# EAGLE schematic EXTRUSOR_1 (EAGLE 7.2.0)
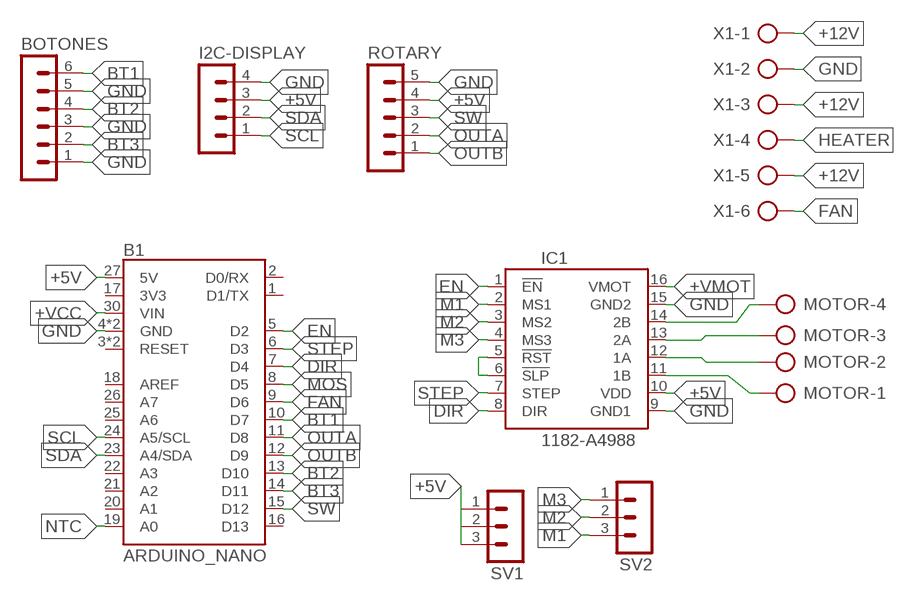
[diagram p0: schematic, sheet 1]

## Parts
B1  ARDUINO_NANO  [NANO]
BOTONES  MA06-1  [MA06-1]
I2C-DISPLAY  MA04-1  [MA04-1]
IC1  1182-A4988  [A4988]
MOTOR  AK500/4  [AK500/4]
ROTARY  MA05-1  [MA05-1]
SV1  MA03-1  [MA03-1]
SV2  MA03-1  [MA03-1]
X1  AK500/6  [AK500/6]

## Nets
+5V: B1.27(5V) I2C-DISPLAY.3 IC1.10(VDD) IC1.11(1B) MOTOR.1 ROTARY.4 SV1.1 SV1.2 SV1.3
+12V: X1.1 X1.3 X1.5
+VCC: B1.30(VIN)
+VMOT: IC1.16(VMOT)
BT1: BOTONES.6
BT2: BOTONES.4
BT3: BOTONES.2
DIR: IC1.8(DIR)
EN: B1.5(D2) IC1.1(!EN)
FAN: X1.6
GND: B1.4(GND) B1.29(GND) BOTONES.1 BOTONES.3 BOTONES.5 I2C-DISPLAY.4 IC1.9(GND1) IC1.15(GND2) ROTARY.5 X1.2
HEATER: X1.4
M1: IC1.2(MS1) SV2.3
M2: IC1.3(MS2) SV2.2
M3: IC1.4(MS3) SV2.1
N$2: IC1.12(1A) MOTOR.2
N$3: IC1.13(2A) MOTOR.3
N$4: IC1.14(2B) MOTOR.4
N$10: IC1.5(!RST) IC1.6(!SLP)
NTC: B1.19(A0)
OUTA: ROTARY.2
OUTB: ROTARY.1
SCL: B1.24(A5/SCL) I2C-DISPLAY.1
SDA: B1.23(A4/SDA) I2C-DISPLAY.2
STEP: IC1.7(STEP)
SW: ROTARY.3
Unconnected: B1.1(D1/TX) B1.2(D0/RX) B1.3(RESET) B1.6(D3) B1.7(D4) B1.8(D5) B1.9(D6) B1.10(D7) B1.11(D8) B1.12(D9) B1.13(D10) B1.14(D11) B1.15(D12) B1.16(D13) B1.17(3V3) B1.18(AREF) B1.20(A1) B1.21(A2) B1.22(A3) B1.25(A6) B1.26(A7) B1.28(RESET)

## Library data of the parts
B1 = treser_lib:ARDUINO_NANO: Arduino Nano
BOTONES = con-lstb:MA06-1: PIN HEADER; OC_FARNELL: unknown; OC_NEWARK: unknown
I2C-DISPLAY = con-lstb:MA04-1: PIN HEADER; OC_FARNELL: unknown; OC_NEWARK: unknown
IC1 = pololu-stepper-driver:1182-A4988: A4988 Stepper Motor Driver Carrier #1182 A4988 Stepper Motor Driver Carrier <https://www.pololu.com/product/1182> in Japan, Suzaku Lab. Ltd. <https://suzakugiken.jp/> #1182 A4988ステッピングモータドライバ <https://szc.jp/po1182>
MOTOR = con-ptr500:AK500/4: CONNECTOR; OC_FARNELL: unknown; OC_NEWARK: unknown
ROTARY = con-lstb:MA05-1: PIN HEADER; OC_FARNELL: unknown; OC_NEWARK: unknown
SV1 SV2 = con-lstb:MA03-1: PIN HEADER; OC_FARNELL: unknown; OC_NEWARK: unknown
X1 = con-ptr500:AK500/6: CONNECTOR; OC_FARNELL: unknown; OC_NEWARK: unknown